# EAGLE design 10DOF_FeatherWing (EAGLE 7.5.0)
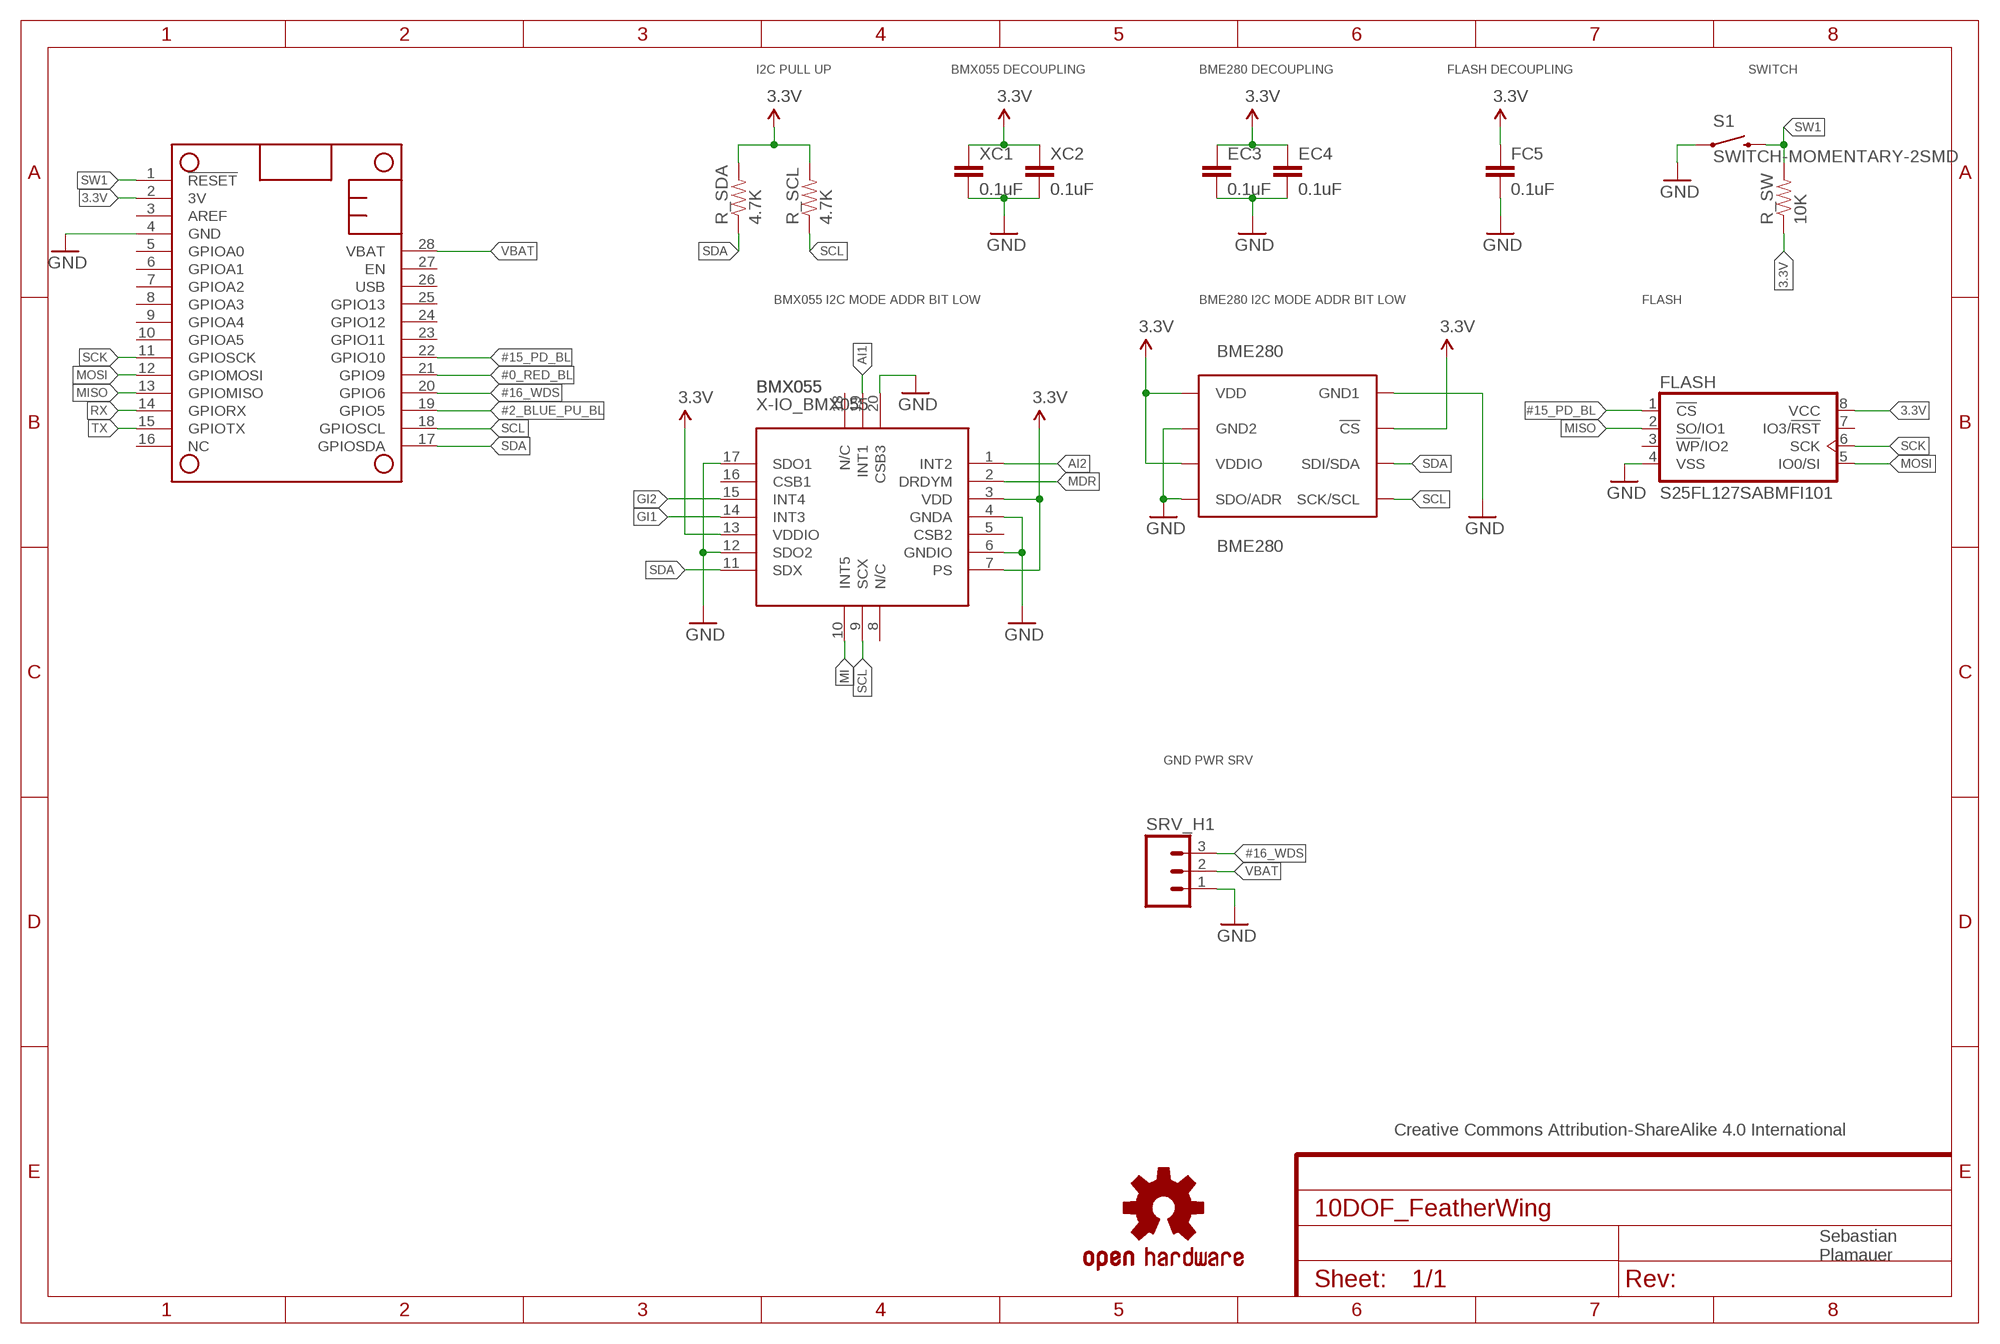
[diagram p0: schematic, sheet 1]

## Parts
BME280  BME280  BME280COMPONENTLIBRARY_BME280  [BME280COMPONENTLIBRARY_BME280_LGA]
BMX055  X-IO_BMX055  [X-IO_BMX055]
EC3  0.1uF  0.1UF-25V(+80/-20%)(0603)  [0603-CAP]
EC4  0.1uF  0.1UF-25V(+80/-20%)(0603)  [0603-CAP]
FC5  0.1uF  0.1UF-25V(+80/-20%)(0603)  [0603-CAP]
FLASH  S25FL127SABMFI101  [SO08-S2A]
LOGO1  OSHW-LOGOS  [OSHW-LOGO-S]
MS1  FEATHERWING  [FEATHERWING]
R_SCL  4.7K  4.7KOHM-1/10W-1%(0603)  [0603-RES]
R_SDA  4.7K  4.7KOHM-1/10W-1%(0603)  [0603-RES]
R_SW  10K  10KOHM-1/10W-1%(0603)0603  [0603-RES]
S1  SWITCH-MOMENTARY-2SMD  [TACTILE-SWITCH-SMD]
SRV_H1  M03PTH  [1X03]
XC1  0.1uF  0.1UF-25V(+80/-20%)(0603)  [0603-CAP]
XC2  0.1uF  0.1UF-25V(+80/-20%)(0603)  [0603-CAP]

## Nets
3.3V: BME280.P$2(!CS) BME280.P$6(VDDIO) BME280.P$8(VDD) BMX055.3(VDD) BMX055.7(PS) BMX055.13(VDDIO) EC3.1 EC4.1 FC5.1 FLASH.8(VCC) MS1.2(3V) R_SCL.2 R_SDA.2 R_SW.1 XC1.1 XC2.1
#0_RED_BL: MS1.21(GPIO9)
#2_BLUE_PU_BL: MS1.19(GPIO5)
#15_PD_BL: FLASH.1(!CS!) MS1.22(GPIO10)
#16_WDS: MS1.20(GPIO6) SRV_H1.3
AI1: BMX055.19(INT1)
AI2: BMX055.1(INT2)
GI1: BMX055.14(INT3)
GI2: BMX055.15(INT4)
GND: BME280.P$1(GND1) BME280.P$5(SDO/ADR) BME280.P$7(GND2) BMX055.4(GNDA) BMX055.6(GNDIO) BMX055.12(SDO2) BMX055.17(SDO1) BMX055.20(CSB3) EC3.2 EC4.2 FC5.2 FLASH.4(VSS) MS1.4(GND) S1.1 SRV_H1.1 XC1.2 XC2.2
MDR: BMX055.2(DRDYM)
MI: BMX055.10(INT5)
MISO: FLASH.2(SO/IO1) MS1.13(GPIOMISO)
MOSI: FLASH.5(IO0/SI) MS1.12(GPIOMOSI)
RX: MS1.14(GPIORX)
SCK: FLASH.6(SCK) MS1.11(GPIOSCK)
SCL: BME280.P$4(SCK/SCL) BMX055.9(SCX) MS1.18(GPIOSCL) R_SCL.1
SDA: BME280.P$3(SDI/SDA) BMX055.11(SDX) MS1.17(GPIOSDA) R_SDA.1
SW1: MS1.1(!RESET) R_SW.2 S1.3
TX: MS1.15(GPIOTX)
VBAT: MS1.28(VBAT) SRV_H1.2
Unconnected: BMX055.5(CSB2) BMX055.8(N/C) BMX055.16(CSB1) BMX055.18(N/C) FLASH.3(!WP!/IO2) FLASH.7(IO3/!RST!) MS1.3(AREF) MS1.5(GPIOA0) MS1.6(GPIOA1) MS1.7(GPIOA2) MS1.8(GPIOA3) MS1.9(GPIOA4) MS1.10(GPIOA5) MS1.16(NC) MS1.23(GPIO11) MS1.24(GPIO12) MS1.25(GPIO13) MS1.26(USB) MS1.27(EN)

## Notes on the sheet
- I2C PULL UP | BMX055 DECOUPLING | BME280 DECOUPLING | FLASH DECOUPLING | SWITCH
- BMX055 I2C MODE ADDR BIT LOW | BME280 I2C MODE ADDR BIT LOW | FLASH
- GND PWR SRV
- Creative Commons Attribution-ShareAlike 4.0 International
- Sebastian
  Plamauer

## Library data of the parts
BME280 = SparkFun_BME280_Breakout_v10:BME280COMPONENTLIBRARY_BME280; PROD_ID: IC-13090
BMX055 = BMX055 Breakout:X-IO_BMX055
EC3 EC4 FC5 XC1 XC2 = SparkFun-Capacitors:0.1UF-25V(+80/-20%)(0603): CAP-00810 Ceramic Standard decoupling cap; PROD_ID: CAP-00810
FLASH = memory-spansion:S25FL127SABMFI101: EEPROM 4 Mbit SPI Serial Flash7
LOGO1 = SparkFun-Aesthetics:OSHW-LOGO: Open Source Hardware Logo This logo indicates the piece of hardware it is found on incorporates a OSHW license and/or adheres to the definition of open source hardware found here: http://freedomdefined.org/OSHW
MS1 = adafruit:FEATHERWING
R_SCL R_SDA = SparkFun-Resistors:4.7KOHM-1/10W-1%(0603): RES-07857; PROD_ID: RES-07857
R_SW = SparkFun-Resistors:10KOHM-1/10W-1%(0603): RES-00824; PROD_ID: RES-00824
S1 = SparkFun-Electromechanical:SWITCH-MOMENTARY-2: Various NO switches- pushbuttons, reed, etc; PROD_ID: SWCH-08247
SRV_H1 = SparkFun-Connectors:M03: Header 3 Standard 3-pin 0.1" header. Use with straight break away headers (SKU : PRT-00116), right angle break away headers (PRT-00553), swiss pins (PRT-00743), machine pins (PRT-00117), and female headers (PRT-00115). Molex polarized connector foot print use with SKU : PRT-08232 with associated crimp pins and housings.

## Board
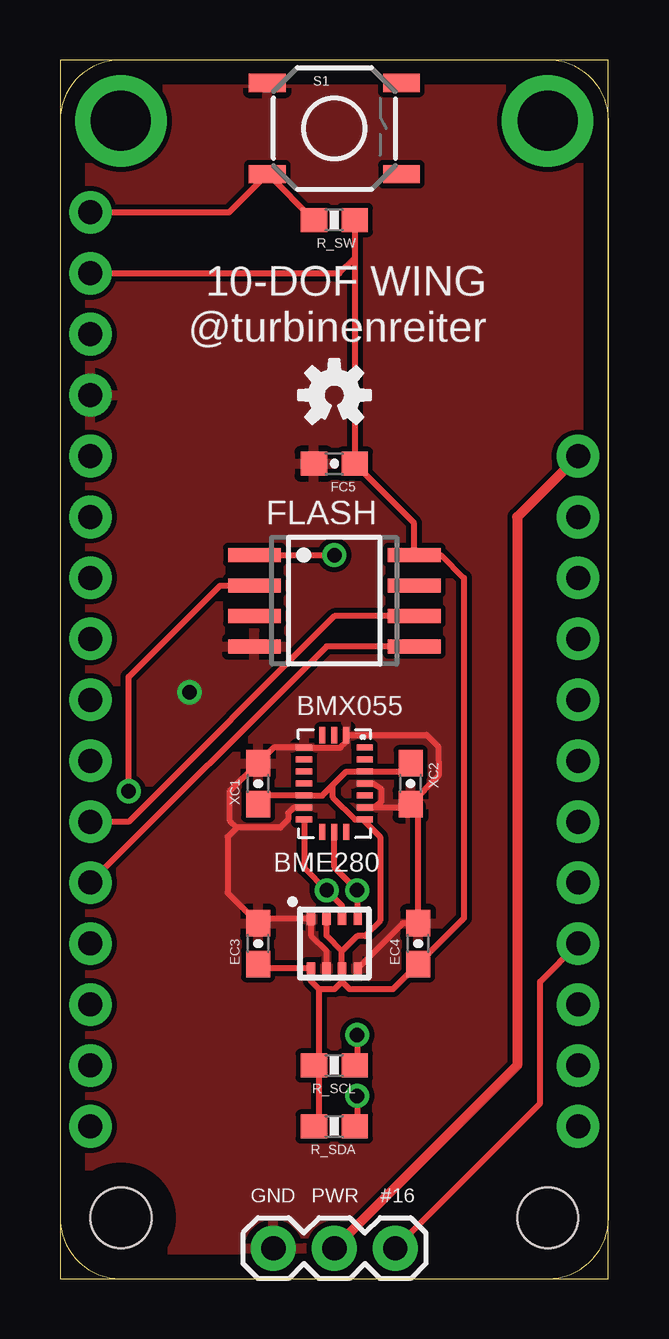
[diagram p1: board, top side]
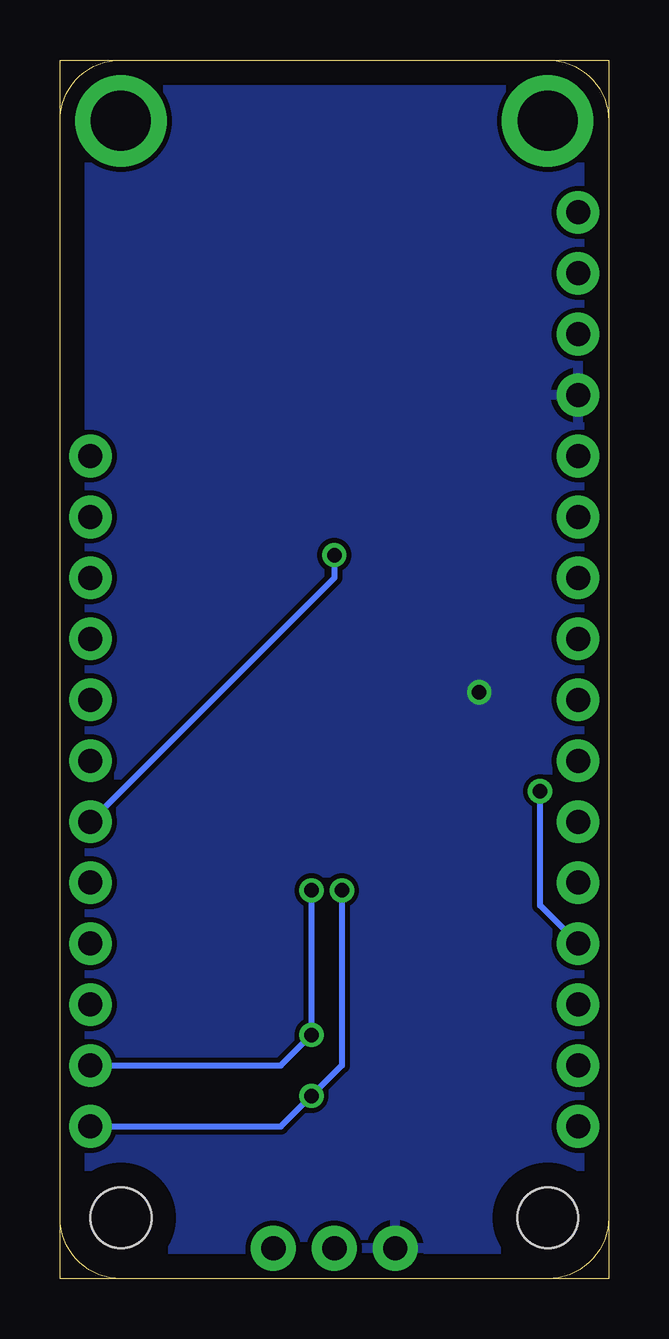
[diagram p2: board, bottom side, seen from below]

Size 22.86 x 50.8 mm. Coordinates in mm from the lower left corner, seen from the top.
Outline: 0,0 22.85,0 22.85,50.79 0,50.79 0,0
Copper layers (1*16): Top 0.035mm / dielectric 1.5mm / Bottom 0.035mm
Design rules "default": minimum track width 10mil, minimum drill 24mil, track to track 8mil, track to pad 8mil, pad to pad 8mil, via to via 8mil, smd to smd 8mil, copper to edge 40mil, drill to drill 8mil, minimum pad ring 10mil, minimum via ring 8mil, stop-mask expansion 4mil, vias tented up to drill 0mil, thermal gap 10mil

### Footprints (pad centres in the part's own frame; a part is rotated, then mirrored left to right if it is on the bottom)
BME280COMPONENTLIBRARY_BME280_LGA = smd 0.5 x 0.35: P$1 1.025,0.975; P$2 1.025,0.325; P$3 1.025,-0.325; P$4 1.025,-0.975; P$5 -1.025,-0.975; P$6 -1.025,-0.325; P$7 -1.025,0.325; P$8 -1.025,0.975
X-IO_BMX055 = smd 0.675 x 0.25: 1 1.262,1.5; 2 1.262,1; 3 1.262,0.5; 4 1.262,0; 5 1.262,-0.5; 6 1.262,-1; 7 1.262,-1.5; 11 -1.262,-1.5; 12 -1.262,-1; 13 -1.262,-0.5; 14 -1.262,0; 15 -1.262,0.5; 16 -1.262,1; 17 -1.262,1.5 | smd 0.25 x 0.675: 8 0.5,-2.013; 9 0,-2.013; 10 -0.5,-2.013; 18 -0.5,2.013; 19 0,2.013; 20 0.5,2.013
0603-CAP = smd 1.1 x 1: 1 -0.85,0; 2 0.85,0
SO08-S2A = smd 0.6 x 2.2: 1 -1.905,-3.33; 2 -0.635,-3.33; 3 0.635,-3.33; 4 1.905,-3.33; 5 1.905,3.33; 6 0.635,3.33; 7 -0.635,3.33; 8 -1.905,3.33
FEATHERWING = drill 1 pad 1.778: 1 6.35,1.27; 2 8.89,1.27; 3 11.43,1.27; 4 13.97,1.27; 5 16.51,1.27; 6 19.05,1.27; 7 21.59,1.27; 8 24.13,1.27; 9 26.67,1.27; 10 29.21,1.27; 11 31.75,1.27; 12 34.29,1.27; 13 36.83,1.27; 14 39.37,1.27; 15 41.91,1.27; 16 44.45,1.27; 17 44.45,21.59; 18 41.91,21.59; 19 39.37,21.59; 20 36.83,21.59; 21 34.29,21.59; 22 31.75,21.59; 23 29.21,21.59; 24 26.67,21.59; 25 24.13,21.59; 26 21.59,21.59; 27 19.05,21.59; 28 16.51,21.59 | drill 2.5 pad 3.81: P$1 2.54,20.32; P$2 2.54,2.54 | hole 2.54: 48.26,20.32; 48.26,2.54
0603-RES = smd 1.1 x 1: 1 -0.85,0; 2 0.85,0
TACTILE-SWITCH-SMD = smd 1.524 x 0.762: 1 -2.794,1.905; 2 2.794,1.905; 3 -2.794,-1.905; 4 2.794,-1.905
1X03 = drill 1.016 pad 1.88: 1 0,0; 2 2.54,0; 3 5.08,0

### Placement (x,y rotation side)
BME280  11.43,13.97 90 top
BMX055  11.43,20.64 0 top
EC3  8.26,13.97 90 top
EC4  14.92,13.97 90 top
FC5  11.43,33.97 180 top
FLASH  11.43,28.26 270 top
LOGO1  11.43,36.83 0 top
MS1  0,50.8 270 top
R_SCL  11.43,8.89 180 top
R_SDA  11.43,6.35 180 top
R_SW  11.43,44.13 180 top
S1  11.43,47.94 0 top
SRV_H1  8.89,1.27 0 top
XC1  8.26,20.64 90 top
XC2  14.61,20.64 270 top

### Tracks (layer width: path | path; a pad name or v marks a point on that pad's centre or on a via)
3.3V
  Top 0.254: EC3.1 8.43,12.95 BME280.P$8 10.46,12.4 10.79,12.06 | BME280.P$6 11.76,12.38 12.06,12.06 13.87,12.06 EC4.1 16.83,15.03 16.83,29.21 15.88,30.16 FLASH.8 14.76,31.49 FC5.1 12.28,42.55 | BME280.P$6 11.75,12.94 11.75,12.38 11.43,12.06 10.79,12.06 | 10.79,12.06 10.79,9.11 R_SCL.2 10.79,8.68 10.79,6.67 10.58,6.45 R_SDA.2 | BME280.P$6 11.75,13.65 | 11.75,13.65 11.11,14.29 BME280.P$2 | XC1.1 8.36,19.79 8.54,20.14 BMX055.13 10.25,20.14 10.93,20.14 11.37,20.58 | 11.37,20.58 11.93,21.14 BMX055.3 14.24,21.14 14.5,21.49 XC2.1 | BMX055.7 12.61,19.14 | 11.37,20.58 11.37,20.07 12.3,19.14 12.61,19.14 | 12.61,19.14 13.34,18.41 13.34,14.92 12.7,14.29 12.38,14.29 11.75,13.65 | R_SW.1 12.28,42.55 | MS1.2 11.64,41.91 12.28,42.55
#15_PD_BL  (via drill 0.6)
  Top 0.254: FLASH.1 v11.43,30.16
  Bottom 0.254: v11.43,30.16 11.43,29.21 MS1.22
#16_WDS
  Top 0.254: SRV_H1.3 20,7.3 20,12.38 MS1.20
GND  (via drill 0.6)
  Top 0.254: 13.07,19.64 14.12,19.64 14.27,19.79 XC2.2 15.78,20.97 15.76,22.19 15.28,22.67 11.93,22.67 11.94,22.66 11.94,22.39 11.93,22.38 | BMX055.6 13.07,19.64 | 13.07,19.64 13.4,19.9 13.4,20.39 13.06,20.63 BMX055.4 | 11.93,22.38 11.69,22.14 BMX055.17 8.9,22.14 XC1.2 7.08,20.32 7.08,19.09 7.36,18.8 9.18,18.81 | 11.93,22.38 BMX055.20 | BMX055.12 9.73,19.64 9.51,19.41 9.51,19.14 9.18,18.81 | EC4.2 14.28,14.82 BME280.P$5 12.4,12.99 12.38,13.02 | BME280.P$7 11.11,13.66 10.48,14.29 10.48,14.97 BME280.P$1 8.43,14.99 EC3.2 6.99,16.09 6.99,18.41 7.38,18.81 9.18,18.81
  other vias: 5.4,24.45
  pour Top: 23.81,-0.64 23.81,51.44 -0.64,51.44 -0.64,-0.64
  pour Bottom: 0,0 23.18,0 23.18,50.8 0,50.8
MISO  (via drill 0.6)
  Top 0.254: v2.86,20.32 2.86,25.08 6.67,28.89 FLASH.2
  Bottom 0.254: MS1.13 2.86,15.56 v2.86,20.32
MOSI
  Top 0.254: FLASH.5 11.11,26.35 MS1.12
N$1
  Top 0.254: 14.92,14.92 14.92,19.68
SCK
  Top 0.254: FLASH.6 11.43,27.62 2.86,19.05 MS1.11
SCL  (via drill 0.6)
  Top 0.254: BMX055.9 11.43,17.14 v12.38,16.19 12.4,16.17 BME280.P$4 | v12.38,10.16 12.38,8.99 R_SCL.1
  Bottom 0.254: v12.38,16.19 v12.38,10.16 13.65,8.89 MS1.18
SDA  (via drill 0.6)
  Top 0.254: BMX055.11 10.17,17.14 v11.11,16.19 11.75,15.56 BME280.P$3 | v12.38,7.62 12.38,6.45 R_SDA.1
  Bottom 0.254: v11.11,16.19 11.11,8.89 v12.38,7.62 13.65,6.35 MS1.17
SW1
  Top 0.254: R_SW.2 8.68,46.04 S1.3 7.05,44.45 MS1.1
VBAT
  Top 0.406: MS1.28 19.05,31.75 19.05,8.89 SRV_H1.2

### Text on the board
tNames: 10-DOF WING / @turbinenreiter | GND | PWR | #16